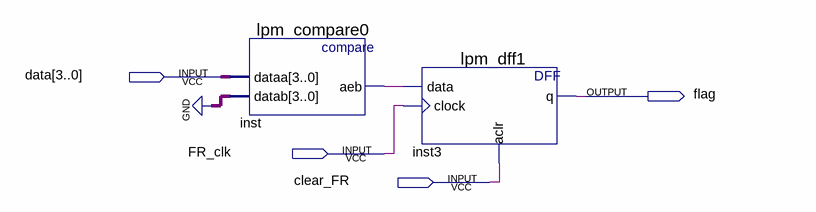
[diagram p0: schematic sheet]
// Quartus schematic FlagRegister.bdf as structural Verilog: 2 symbols, 4 pins
module FlagRegister (
  input  [3:0] data,
  input  FR_clk,
  input  clear_FR,
  output flag
);

  wire inst_aeb;

  lpm_compare0 inst (.dataa(data), .datab(4'b0000), .aeb(inst_aeb));
  lpm_dff1 inst3 (.data(inst_aeb), .clock(FR_clk), .aclr(clear_FR), .q(flag));
endmodule
